# Altium schematic sheet STM32_MPU_IOs.SchDoc: MPU
size A3; SheetNumber: 3; SheetTotal: 7
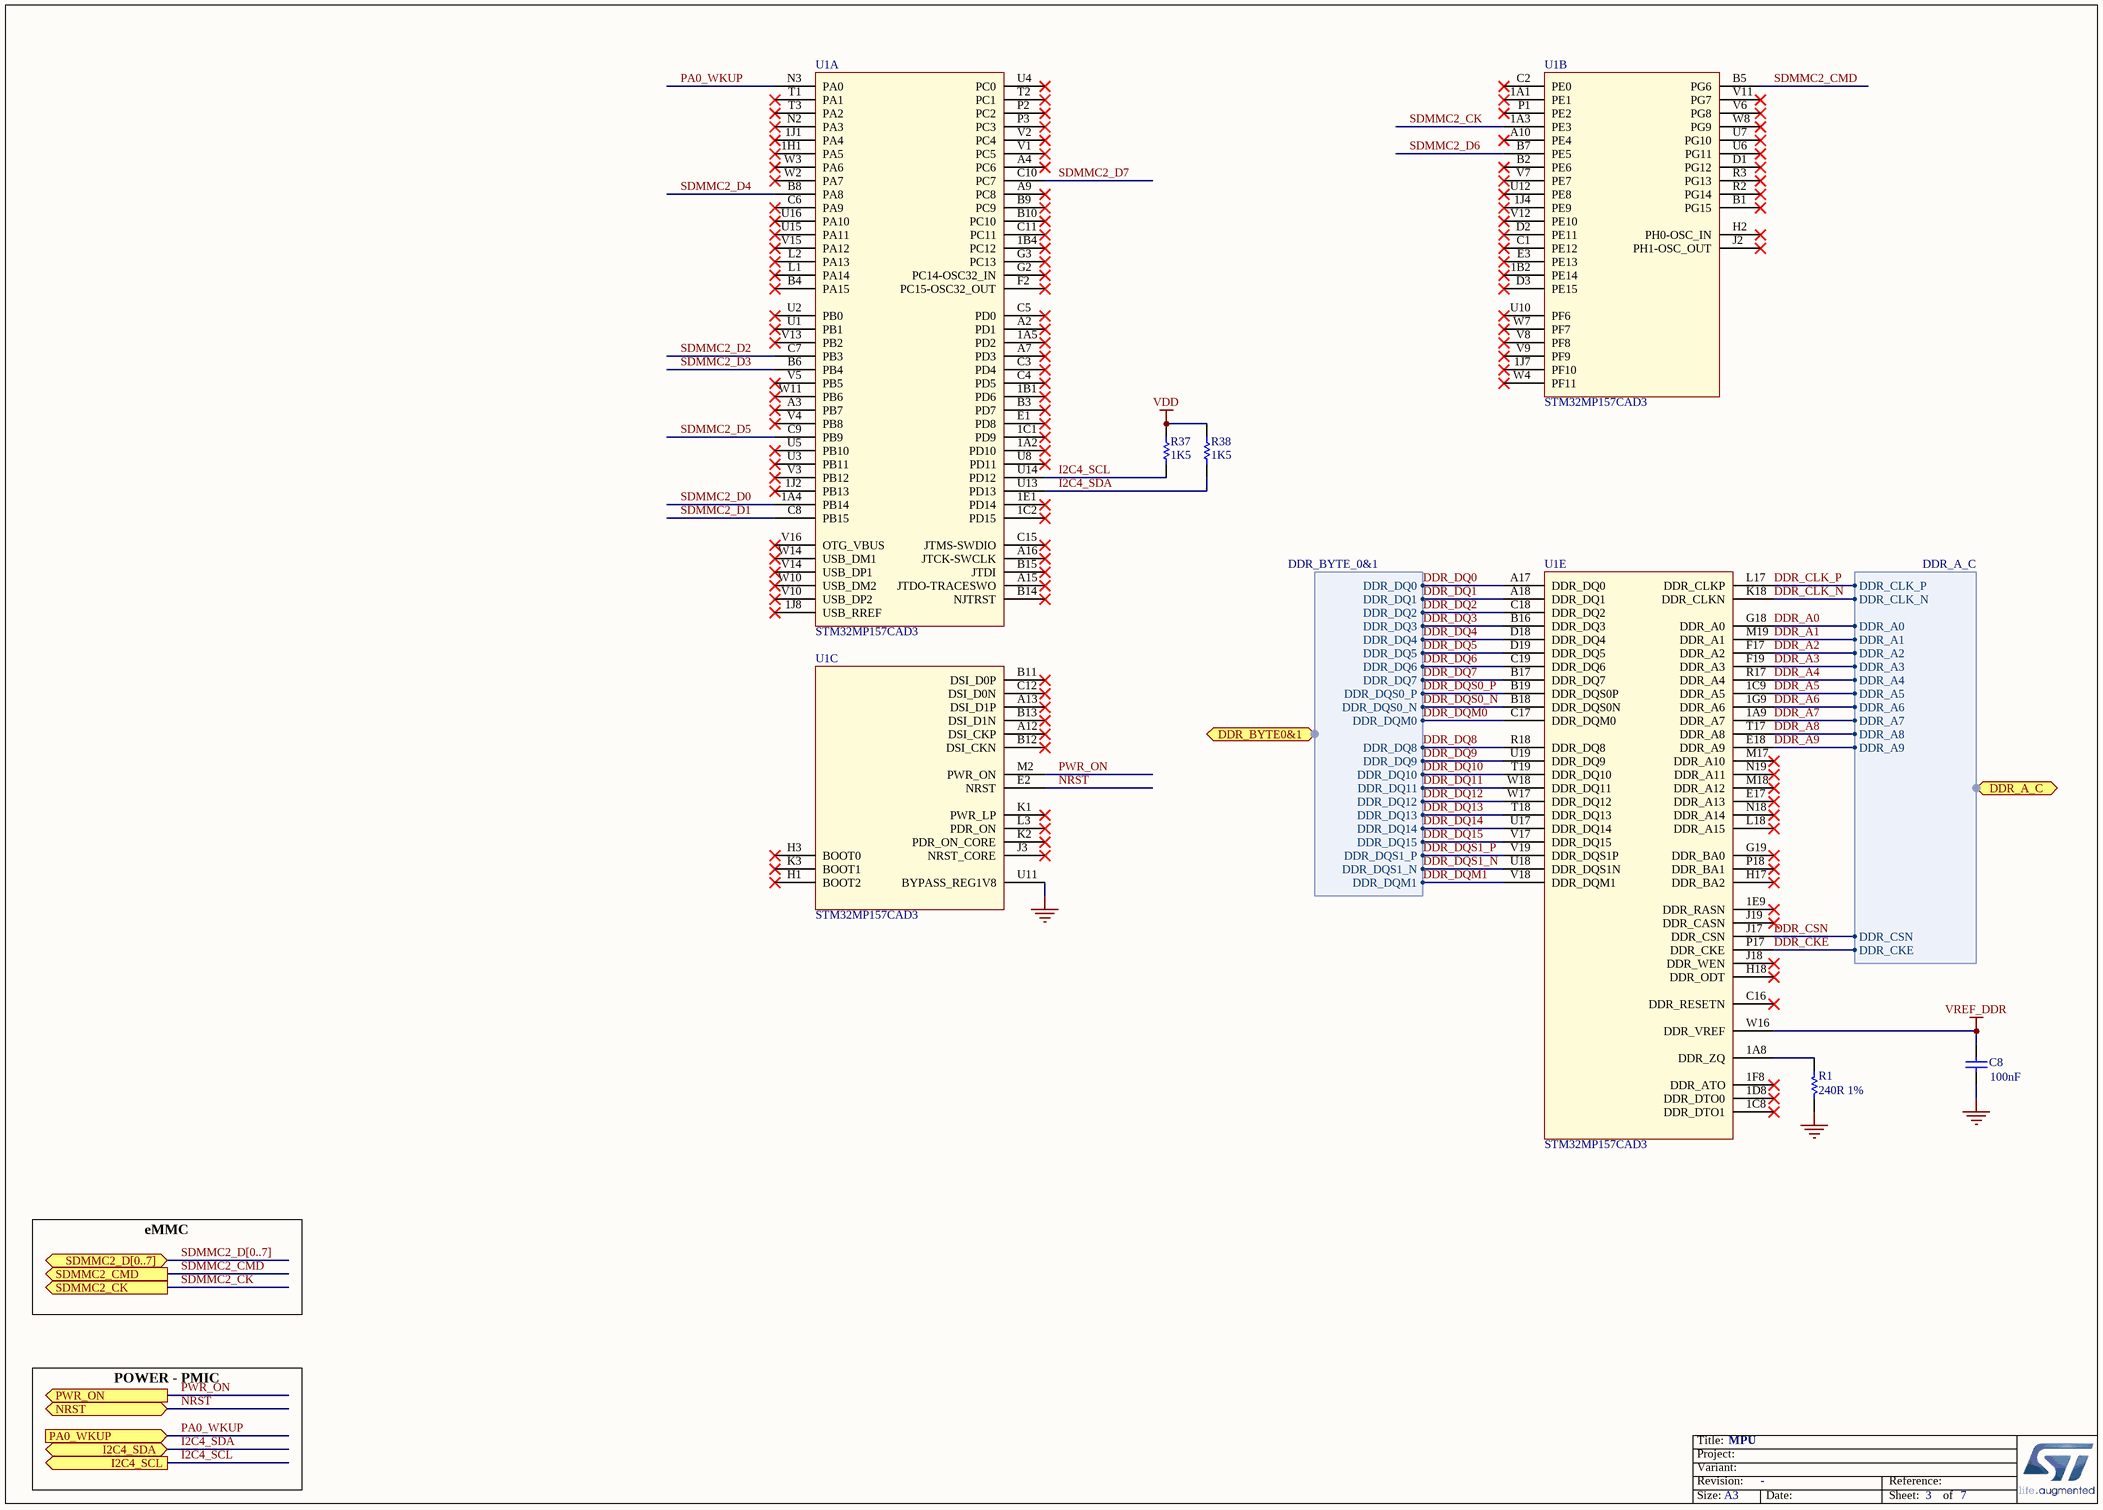
[diagram p0: STM32_MPU_IOs.SchDoc]

## Parts
C8  value 100nF  [C0402]
R1  value 240R 1%  [R0402]
R37  value 1K5  [R0402]
R38  value 1K5  [R0402]
U1  value STM32MP157CAD3  [ICC_TFBGA257_10X10_STM32MP157CAD3_P050-065]  (parts A,B,C,E of 5)

## Ports
DDR_A_C (harness DDR_A_C), DDR_BYTE0&1 (harness DDR_BYTE_0&1), I2C4_SCL (out), I2C4_SDA (bidir), NRST (bidir), PA0_WKUP (in), PWR_ON (out), SDMMC2_CK (out), SDMMC2_CMD (out), SDMMC2_D[0..7] (bidir)

## Harnesses
DDR_BYTE_0&1: DDR_DQ0, DDR_DQ1, DDR_DQ2, DDR_DQ3, DDR_DQ4, DDR_DQ5, DDR_DQ6, DDR_DQ7, DDR_DQS0_P, DDR_DQS0_N, DDR_DQM0, DDR_DQ8, DDR_DQ9, DDR_DQ10, DDR_DQ11, DDR_DQ12, DDR_DQ13, DDR_DQ14, DDR_DQ15, DDR_DQS1_P, DDR_DQS1_N, DDR_DQM1
DDR_A_C: DDR_CLK_P, DDR_CLK_N, DDR_A0, DDR_A1, DDR_A2, DDR_A3, DDR_A4, DDR_A5, DDR_A6, DDR_A7, DDR_A8, DDR_A9, DDR_CSN, DDR_CKE

## Nets
GND: C8.1 R1.2 U1.U11(BYPASS_REG1V8)
VDD: R37.1 R38.1
VREF_DDR: C8.2 U1.W16(DDR_VREF)
DDR_A0: U1.G18(DDR_A0) ; port DDR_A_C.DDR_A0
DDR_A1: U1.M19(DDR_A1) ; port DDR_A_C.DDR_A1
DDR_A2: U1.F17(DDR_A2) ; port DDR_A_C.DDR_A2
DDR_A3: U1.F19(DDR_A3) ; port DDR_A_C.DDR_A3
DDR_A4: U1.R17(DDR_A4) ; port DDR_A_C.DDR_A4
DDR_A5: U1.1C9(DDR_A5) ; port DDR_A_C.DDR_A5
DDR_A6: U1.1G9(DDR_A6) ; port DDR_A_C.DDR_A6
DDR_A7: U1.1A9(DDR_A7) ; port DDR_A_C.DDR_A7
DDR_A8: U1.T17(DDR_A8) ; port DDR_A_C.DDR_A8
DDR_A9: U1.E18(DDR_A9) ; port DDR_A_C.DDR_A9
DDR_CKE: U1.P17(DDR_CKE) ; port DDR_A_C.DDR_CKE
DDR_CLK_N: U1.K18(DDR_CLKN) ; port DDR_A_C.DDR_CLK_N
DDR_CLK_P: U1.L17(DDR_CLKP) ; port DDR_A_C.DDR_CLK_P
DDR_CSN: U1.J17(DDR_CSN) ; port DDR_A_C.DDR_CSN
DDR_DQ0: U1.A17(DDR_DQ0) ; port DDR_BYTE0&1.DDR_DQ0
DDR_DQ1: U1.A18(DDR_DQ1) ; port DDR_BYTE0&1.DDR_DQ1
DDR_DQ2: U1.C18(DDR_DQ2) ; port DDR_BYTE0&1.DDR_DQ2
DDR_DQ3: U1.B16(DDR_DQ3) ; port DDR_BYTE0&1.DDR_DQ3
DDR_DQ4: U1.D18(DDR_DQ4) ; port DDR_BYTE0&1.DDR_DQ4
DDR_DQ5: U1.D19(DDR_DQ5) ; port DDR_BYTE0&1.DDR_DQ5
DDR_DQ6: U1.C19(DDR_DQ6) ; port DDR_BYTE0&1.DDR_DQ6
DDR_DQ7: U1.B17(DDR_DQ7) ; port DDR_BYTE0&1.DDR_DQ7
DDR_DQ8: U1.R18(DDR_DQ8) ; port DDR_BYTE0&1.DDR_DQ8
DDR_DQ9: U1.U19(DDR_DQ9) ; port DDR_BYTE0&1.DDR_DQ9
DDR_DQ10: U1.T19(DDR_DQ10) ; port DDR_BYTE0&1.DDR_DQ10
DDR_DQ11: U1.W18(DDR_DQ11) ; port DDR_BYTE0&1.DDR_DQ11
DDR_DQ12: U1.W17(DDR_DQ12) ; port DDR_BYTE0&1.DDR_DQ12
DDR_DQ13: U1.T18(DDR_DQ13) ; port DDR_BYTE0&1.DDR_DQ13
DDR_DQ14: U1.U17(DDR_DQ14) ; port DDR_BYTE0&1.DDR_DQ14
DDR_DQ15: U1.V17(DDR_DQ15) ; port DDR_BYTE0&1.DDR_DQ15
DDR_DQM0: U1.C17(DDR_DQM0) ; port DDR_BYTE0&1.DDR_DQM0
DDR_DQM1: U1.V18(DDR_DQM1) ; port DDR_BYTE0&1.DDR_DQM1
DDR_DQS0_N: U1.B18(DDR_DQS0N) ; port DDR_BYTE0&1.DDR_DQS0_N
DDR_DQS0_P: U1.B19(DDR_DQS0P) ; port DDR_BYTE0&1.DDR_DQS0_P
DDR_DQS1_N: U1.U18(DDR_DQS1N) ; port DDR_BYTE0&1.DDR_DQS1_N
DDR_DQS1_P: U1.V19(DDR_DQS1P) ; port DDR_BYTE0&1.DDR_DQS1_P
I2C4_SCL: R37.2 U1.U14(PD12) ; port I2C4_SCL
I2C4_SDA: R38.2 U1.U13(PD13) ; port I2C4_SDA
NRST: U1.E2(NRST) ; port NRST
PA0_WKUP: U1.N3(PA0) ; port PA0_WKUP
PWR_ON: U1.M2(PWR_ON) ; port PWR_ON
SDMMC2_CK: U1.1A3(PE3) ; port SDMMC2_CK
SDMMC2_CMD: U1.B5(PG6) ; port SDMMC2_CMD
SDMMC2_D0: U1.1A4(PB14)
SDMMC2_D1: U1.C8(PB15)
SDMMC2_D2: U1.C7(PB3)
SDMMC2_D3: U1.B6(PB4)
SDMMC2_D4: U1.B8(PA8)
SDMMC2_D5: U1.C9(PB9)
SDMMC2_D6: U1.B7(PE5)
SDMMC2_D7: U1.C10(PC7)
NetR1_1: R1.1 U1.1A8(DDR_ZQ)

Not connected (* = marked no-connect by the designer): U1 1A1(PE1)* 1A2(PD10)* 1A5(PD2)* 1B1(PD6)* 1B2(PE14)* 1B4(PC12)* 1C1(PD9)* 1C2(PD15)* 1C8(DDR_DTO1)* 1D8(DDR_DTO0)* 1E1(PD14)* 1E9(DDR_RASN)* 1F8(DDR_ATO)* 1H1(PA5)* 1J1(PA4)* 1J2(PB13)* 1J4(PE9)* 1J7(PF10)* 1J8(USB_RREF)* A2(PD1)* A3(PB7)* A4(PC6)* A7(PD3)* A9(PC8)* A10(PE4)* A12(DSI_CKP)* A13(DSI_D1P)* A15(JTDO-TRACESWO)* A16(JTCK-SWCLK)* B1(PG15)* B2(PE6)* B3(PD7)* B4(PA15)* B9(PC9)* B10(PC10)* B11(DSI_D0P)* B12(DSI_CKN)* B13(DSI_D1N)* B14(NJTRST)* B15(JTDI)* C1(PE12)* C2(PE0)* C3(PD4)* C4(PD5)* C5(PD0)* C6(PA9)* C11(PC11)* C12(DSI_D0N)* C15(JTMS-SWDIO)* C16(DDR_RESETN)* D1(PG12)* D2(PE11)* D3(PE15)* E1(PD8)* E3(PE13)* E17(DDR_A13)* F2(PC15-OSC32_OUT)* G2(PC14-OSC32_IN)* G3(PC13)* G19(DDR_BA0)* H1(BOOT2)* H2(PH0-OSC_IN)* H3(BOOT0)* H17(DDR_BA2)* H18(DDR_ODT)* J2(PH1-OSC_OUT)* J3(NRST_CORE)* J18(DDR_WEN)* J19(DDR_CASN)* K1(PWR_LP)* K2(PDR_ON_CORE)* K3(BOOT1)* L1(PA14)* L2(PA13)* L3(PDR_ON)* L18(DDR_A15)* M17(DDR_A10)* M18(DDR_A12)* N2(PA3)* N18(DDR_A14)* N19(DDR_A11)* P1(PE2)* P2(PC2)* P3(PC3)* P18(DDR_BA1)* R2(PG14)* R3(PG13)* T1(PA1)* T2(PC1)* T3(PA2)* U1(PB1)* U2(PB0)* U3(PB11)* U4(PC0)* U5(PB10)* U6(PG11)* U7(PG10)* U8(PD11)* U10(PF6)* U12(PE8)* U15(PA11)* U16(PA10)* V1(PC5)* V2(PC4)* V3(PB12)* V4(PB8)* V5(PB5)* V6(PG8)* V7(PE7)* V8(PF8)* V9(PF9)* V10(USB_DP2)* V11(PG7)* V12(PE10)* V13(PB2)* V14(USB_DP1)* V15(PA12)* V16(OTG_VBUS)* W2(PA7)* W3(PA6)* W4(PF11)* W7(PF7)* W8(PG9)* W10(USB_DM2)* W11(PB6)* W14(USB_DM1)*

## Buses and harness runs
bus SDMMC2_D[0..7] = port SDMMC2_D[0..7]

## Notes on the sheet
- eMMC
- POWER - PMIC
- Title:
- Project:
- Size:
- Revision:
- Variant:
- A3
- -
- Date:
- Reference:
- Sheet:
- of

## Library data of the parts
C8 = MCD-00006: Capacitor, MLCC, 100nF, 16V, X7R, 10%, 0402, T=0.5mm; Manufacturer_Part_Number: CC0402KRX7R7BB104; Manufacturer: YAGEO; Alternate_Manufacturer_Part_Number: GCM155R71C104KA55D; Alternate_Manufacturer: MURATA; ECCN_US: EAR99; ECCN_EU: NEC; Provided_By: SUBCO; Internal_Part_Number: MCD-00006; ComponentLink1Description: Datasheet; Status: Released; Part_Type: Capacitor; Package: C0402; ComponentLink1URL: http://tunmcdsvn.tun.st.com/Component_Datasheet_Library/Trunk/Capacitors/Yageo_Multilayer_Capacitor_X7R_series_100pF_to_22uF
R1 = MCD-00120: Resistor,240R,0402,1%,1/16W; Manufacturer_Part_Number: RC0402FR-07240RL; Manufacturer: YAGEO; ECCN_US: EAR99; ECCN_EU: NEC; Provided_By: SUBCO; Internal_Part_Number: MCD-00120; ComponentLink1Description: Datasheet; Status: Released; Part_Type: Resistor; ComponentLink1URL: http://tunmcdsvn.tun.st.com/Component_Datasheet_Library/Trunk/Resistors/Yageo_Resistor_RC0402-series; Package: R0402
R37 R38 = MCD-00068: Resistor,1K5,0402,1%,1/16W; Manufacturer_Part_Number: RC0402FR-071K5L; Manufacturer: YAGEO; ECCN_US: EAR99; ECCN_EU: NEC; Provided_By: SUBCO; Internal_Part_Number: MCD-00068; ComponentLink1Description: Datasheet; Status: Released; Part_Type: Resistor; ComponentLink1URL: http://tunmcdsvn.tun.st.com/Component_Datasheet_Library/Trunk/Resistors/Yageo_Resistor_RC0402-series; Package: R0402
U1 = MCD-01144: MPU TFBGA10x10 secure boot+crypto; Part_Type: IC; Manufacturer: STMICROELECTRONICS; Provided_By: SUBCO with ST control; ECCN_US: 5A002A4; Internal_Part_Number: MCD-01144; Status: Footprint available; Manufacturer_Part_Number: STM32MP157CAD3; ComponentLink1Description: Datasheet; ComponentLink1URL: http://TBD; ECCN_EU: 5A002A4